# EAGLE design Light Sensors (EAGLE 8.7.0)
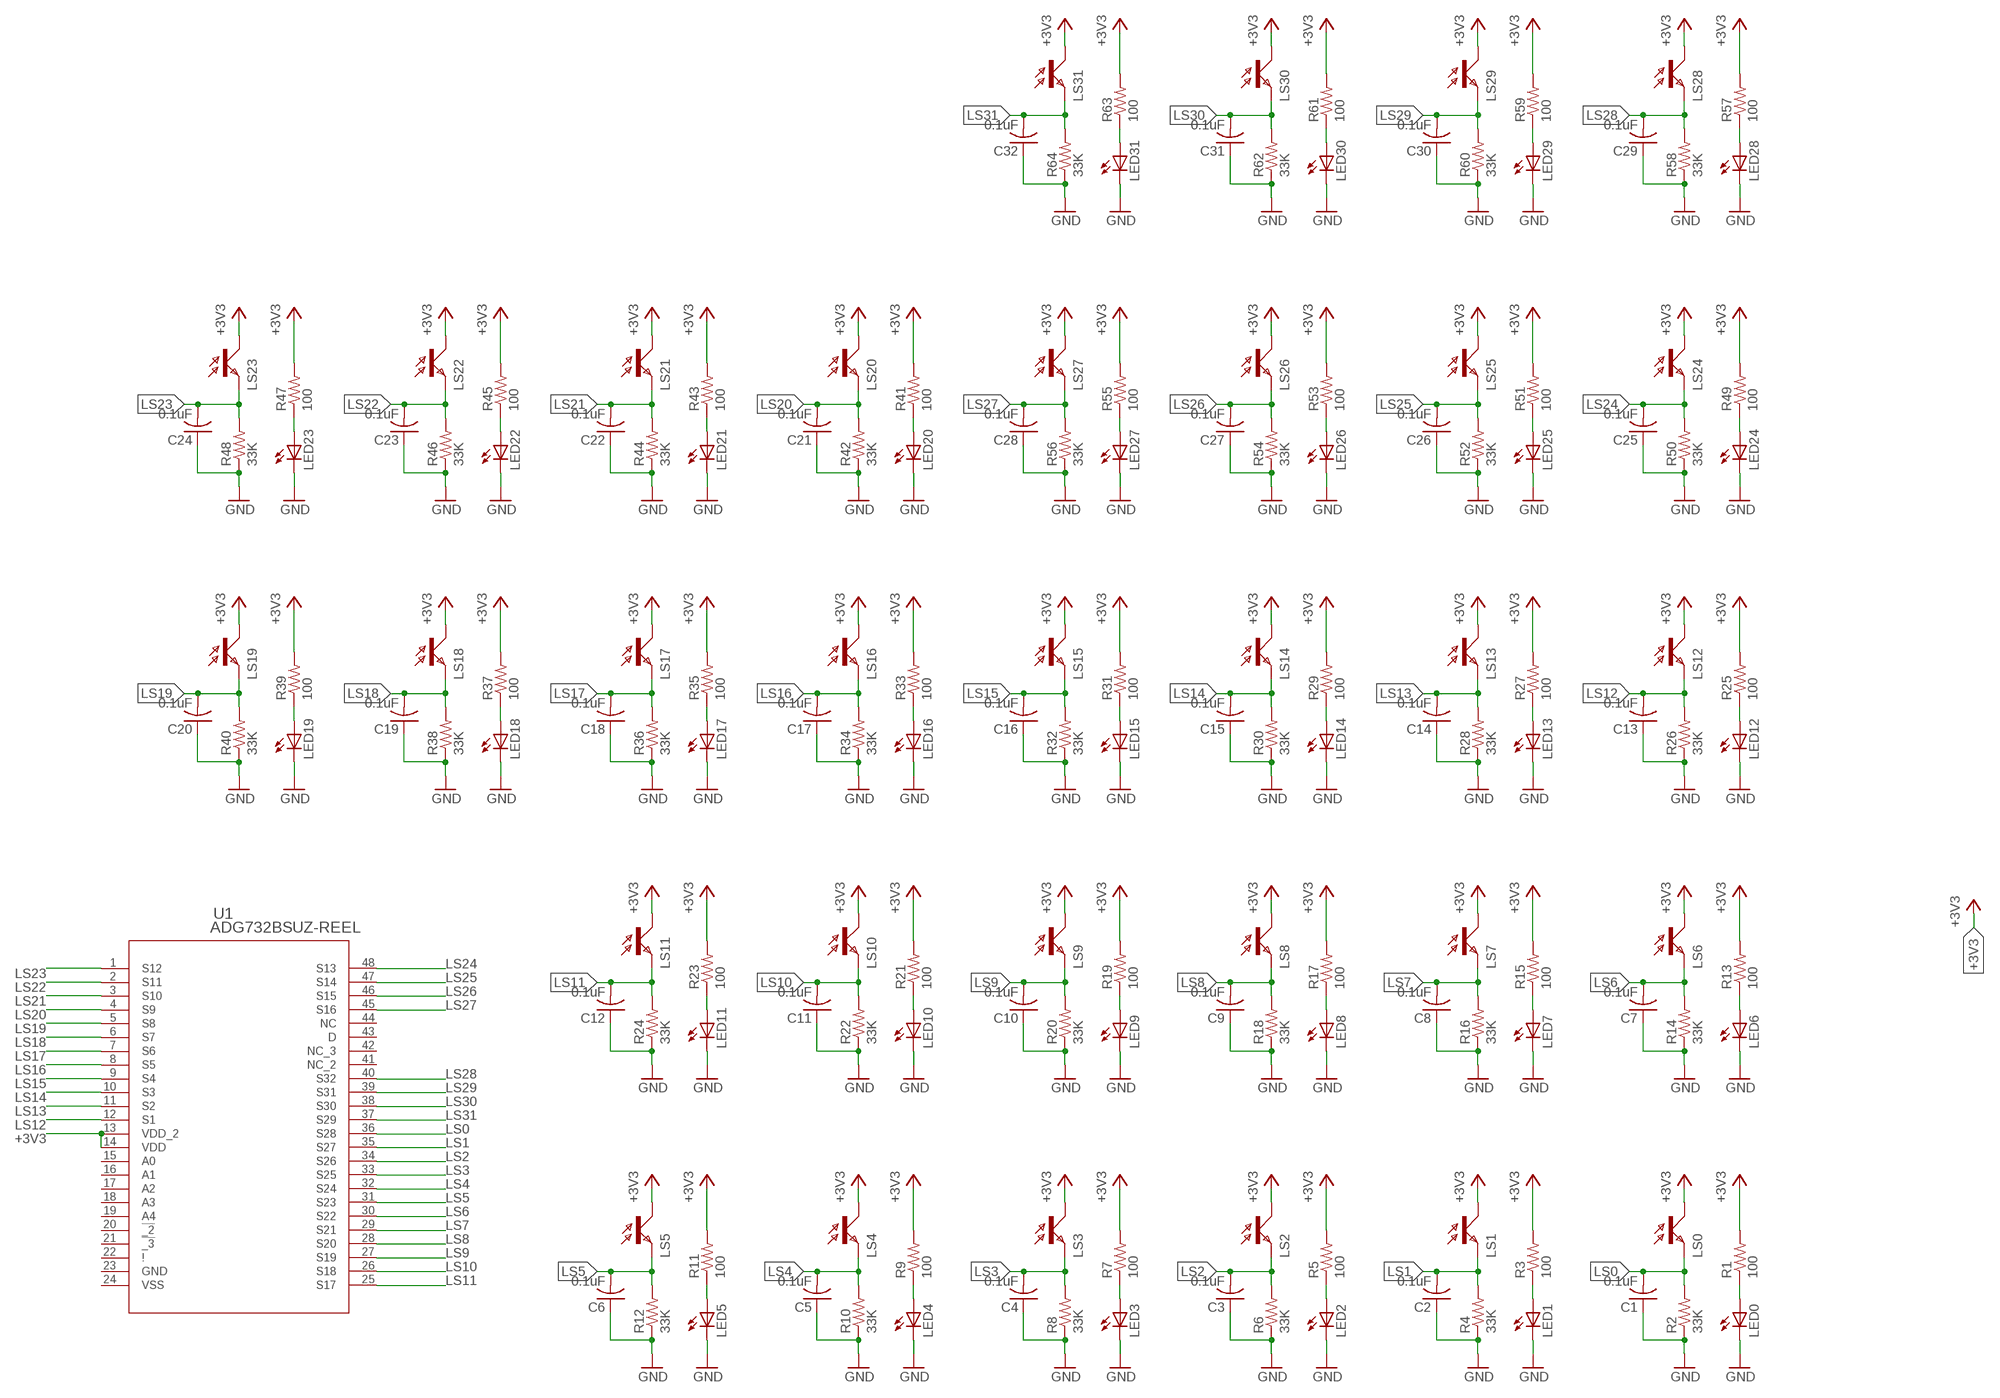
[diagram p0: schematic, sheet 1]

## Parts
C1  0.1uF  C-USC0603  [C0603]
C2  0.1uF  C-USC0603  [C0603]
C3  0.1uF  C-USC0603  [C0603]
C4  0.1uF  C-USC0603  [C0603]
C5  0.1uF  C-USC0603  [C0603]
C6  0.1uF  C-USC0603  [C0603]
C7  0.1uF  C-USC0603  [C0603]
C8  0.1uF  C-USC0603  [C0603]
C9  0.1uF  C-USC0603  [C0603]
C10  0.1uF  C-USC0603  [C0603]
C11  0.1uF  C-USC0603  [C0603]
C12  0.1uF  C-USC0603  [C0603]
C13  0.1uF  C-USC0603  [C0603]
C14  0.1uF  C-USC0603  [C0603]
C15  0.1uF  C-USC0603  [C0603]
C16  0.1uF  C-USC0603  [C0603]
C17  0.1uF  C-USC0603  [C0603]
C18  0.1uF  C-USC0603  [C0603]
C19  0.1uF  C-USC0603  [C0603]
C20  0.1uF  C-USC0603  [C0603]
C21  0.1uF  C-USC0603  [C0603]
C22  0.1uF  C-USC0603  [C0603]
C23  0.1uF  C-USC0603  [C0603]
C24  0.1uF  C-USC0603  [C0603]
C25  0.1uF  C-USC0603  [C0603]
C26  0.1uF  C-USC0603  [C0603]
C27  0.1uF  C-USC0603  [C0603]
C28  0.1uF  C-USC0603  [C0603]
C29  0.1uF  C-USC0603  [C0603]
C30  0.1uF  C-USC0603  [C0603]
C31  0.1uF  C-USC0603  [C0603]
C32  0.1uF  C-USC0603  [C0603]
LED0  LEDCHIPLED_0603  [CHIPLED_0603]
LED1  LEDCHIPLED_0603  [CHIPLED_0603]
LED2  LEDCHIPLED_0603  [CHIPLED_0603]
LED3  LEDCHIPLED_0603  [CHIPLED_0603]
LED4  LEDCHIPLED_0603  [CHIPLED_0603]
LED5  LEDCHIPLED_0603  [CHIPLED_0603]
LED6  LEDCHIPLED_0603  [CHIPLED_0603]
LED7  LEDCHIPLED_0603  [CHIPLED_0603]
LED8  LEDCHIPLED_0603  [CHIPLED_0603]
LED9  LEDCHIPLED_0603  [CHIPLED_0603]
LED10  LEDCHIPLED_0603  [CHIPLED_0603]
LED11  LEDCHIPLED_0603  [CHIPLED_0603]
LED12  LEDCHIPLED_0603  [CHIPLED_0603]
LED13  LEDCHIPLED_0603  [CHIPLED_0603]
LED14  LEDCHIPLED_0603  [CHIPLED_0603]
LED15  LEDCHIPLED_0603  [CHIPLED_0603]
LED16  LEDCHIPLED_0603  [CHIPLED_0603]
LED17  LEDCHIPLED_0603  [CHIPLED_0603]
LED18  LEDCHIPLED_0603  [CHIPLED_0603]
LED19  LEDCHIPLED_0603  [CHIPLED_0603]
LED20  LEDCHIPLED_0603  [CHIPLED_0603]
LED21  LEDCHIPLED_0603  [CHIPLED_0603]
LED22  LEDCHIPLED_0603  [CHIPLED_0603]
LED23  LEDCHIPLED_0603  [CHIPLED_0603]
LED24  LEDCHIPLED_0603  [CHIPLED_0603]
LED25  LEDCHIPLED_0603  [CHIPLED_0603]
LED26  LEDCHIPLED_0603  [CHIPLED_0603]
LED27  LEDCHIPLED_0603  [CHIPLED_0603]
LED28  LEDCHIPLED_0603  [CHIPLED_0603]
LED29  LEDCHIPLED_0603  [CHIPLED_0603]
LED30  LEDCHIPLED_0603  [CHIPLED_0603]
LED31  LEDCHIPLED_0603  [CHIPLED_0603]
LS0  ALS  [SMD]
LS1  ALS  [SMD]
LS2  ALS  [SMD]
LS3  ALS  [SMD]
LS4  ALS  [SMD]
LS5  ALS  [SMD]
LS6  ALS  [SMD]
LS7  ALS  [SMD]
LS8  ALS  [SMD]
LS9  ALS  [SMD]
LS10  ALS  [SMD]
LS11  ALS  [SMD]
LS12  ALS  [SMD]
LS13  ALS  [SMD]
LS14  ALS  [SMD]
LS15  ALS  [SMD]
LS16  ALS  [SMD]
LS17  ALS  [SMD]
LS18  ALS  [SMD]
LS19  ALS  [SMD]
LS20  ALS  [SMD]
LS21  ALS  [SMD]
LS22  ALS  [SMD]
LS23  ALS  [SMD]
LS24  ALS  [SMD]
LS25  ALS  [SMD]
LS26  ALS  [SMD]
LS27  ALS  [SMD]
LS28  ALS  [SMD]
LS29  ALS  [SMD]
LS30  ALS  [SMD]
LS31  ALS  [SMD]
R1  100  R-US_R0603  [R0603]
R2  33K  R-US_R0603  [R0603]
R3  100  R-US_R0603  [R0603]
R4  33K  R-US_R0603  [R0603]
R5  100  R-US_R0603  [R0603]
R6  33K  R-US_R0603  [R0603]
R7  100  R-US_R0603  [R0603]
R8  33K  R-US_R0603  [R0603]
R9  100  R-US_R0603  [R0603]
R10  33K  R-US_R0603  [R0603]
R11  100  R-US_R0603  [R0603]
R12  33K  R-US_R0603  [R0603]
R13  100  R-US_R0603  [R0603]
R14  33K  R-US_R0603  [R0603]
R15  100  R-US_R0603  [R0603]
R16  33K  R-US_R0603  [R0603]
R17  100  R-US_R0603  [R0603]
R18  33K  R-US_R0603  [R0603]
R19  100  R-US_R0603  [R0603]
R20  33K  R-US_R0603  [R0603]
R21  100  R-US_R0603  [R0603]
R22  33K  R-US_R0603  [R0603]
R23  100  R-US_R0603  [R0603]
R24  33K  R-US_R0603  [R0603]
R25  100  R-US_R0603  [R0603]
R26  33K  R-US_R0603  [R0603]
R27  100  R-US_R0603  [R0603]
R28  33K  R-US_R0603  [R0603]
R29  100  R-US_R0603  [R0603]
R30  33K  R-US_R0603  [R0603]
R31  100  R-US_R0603  [R0603]
R32  33K  R-US_R0603  [R0603]
R33  100  R-US_R0603  [R0603]
R34  33K  R-US_R0603  [R0603]
R35  100  R-US_R0603  [R0603]
R36  33K  R-US_R0603  [R0603]
R37  100  R-US_R0603  [R0603]
R38  33K  R-US_R0603  [R0603]
R39  100  R-US_R0603  [R0603]
R40  33K  R-US_R0603  [R0603]
R41  100  R-US_R0603  [R0603]
R42  33K  R-US_R0603  [R0603]
R43  100  R-US_R0603  [R0603]
R44  33K  R-US_R0603  [R0603]
R45  100  R-US_R0603  [R0603]
R46  33K  R-US_R0603  [R0603]
R47  100  R-US_R0603  [R0603]
R48  33K  R-US_R0603  [R0603]
R49  100  R-US_R0603  [R0603]
R50  33K  R-US_R0603  [R0603]
R51  100  R-US_R0603  [R0603]
R52  33K  R-US_R0603  [R0603]
R53  100  R-US_R0603  [R0603]
R54  33K  R-US_R0603  [R0603]
R55  100  R-US_R0603  [R0603]
R56  33K  R-US_R0603  [R0603]
R57  100  R-US_R0603  [R0603]
R58  33K  R-US_R0603  [R0603]
R59  100  R-US_R0603  [R0603]
R60  33K  R-US_R0603  [R0603]
R61  100  R-US_R0603  [R0603]
R62  33K  R-US_R0603  [R0603]
R63  100  R-US_R0603  [R0603]
R64  33K  R-US_R0603  [R0603]
U1  ADG732BSUZ-REEL  [SU_48]

## Nets
+3V3: LS0.C LS1.C LS2.C LS3.C LS4.C LS5.C LS6.C LS7.C LS8.C LS9.C LS10.C LS11.C LS12.C LS13.C LS14.C LS15.C LS16.C LS17.C LS18.C LS19.C LS20.C LS21.C LS22.C LS23.C LS24.C LS25.C LS26.C LS27.C LS28.C LS29.C LS30.C LS31.C R1.2 R3.2 R5.2 R7.2 R9.2 R11.2 R13.2 R15.2 R17.2 R19.2 R21.2 R23.2 R25.2 R27.2 R29.2 R31.2 R33.2 R35.2 R37.2 R39.2 R41.2 R43.2 R45.2 R47.2 R49.2 R51.2 R53.2 R55.2 R57.2 R59.2 R61.2 R63.2 U1.13(VDD_2) U1.14(VDD)
GND: C1.1 C2.1 C3.1 C4.1 C5.1 C6.1 C7.1 C8.1 C9.1 C10.1 C11.1 C12.1 C13.1 C14.1 C15.1 C16.1 C17.1 C18.1 C19.1 C20.1 C21.1 C22.1 C23.1 C24.1 C25.1 C26.1 C27.1 C28.1 C29.1 C30.1 C31.1 C32.1 LED0.C LED1.C LED2.C LED3.C LED4.C LED5.C LED6.C LED7.C LED8.C LED9.C LED10.C LED11.C LED12.C LED13.C LED14.C LED15.C LED16.C LED17.C LED18.C LED19.C LED20.C LED21.C LED22.C LED23.C LED24.C LED25.C LED26.C LED27.C LED28.C LED29.C LED30.C LED31.C R2.1 R4.1 R6.1 R8.1 R10.1 R12.1 R14.1 R16.1 R18.1 R20.1 R22.1 R24.1 R26.1 R28.1 R30.1 R32.1 R34.1 R36.1 R38.1 R40.1 R42.1 R44.1 R46.1 R48.1 R50.1 R52.1 R54.1 R56.1 R58.1 R60.1 R62.1 R64.1
LS0: C1.2 LS0.E R2.2 U1.36(S28)
LS1: C2.2 LS1.E R4.2 U1.35(S27)
LS2: C3.2 LS2.E R6.2 U1.34(S26)
LS3: C4.2 LS3.E R8.2 U1.33(S25)
LS4: C5.2 LS4.E R10.2 U1.32(S24)
LS5: C6.2 LS5.E R12.2 U1.31(S23)
LS6: C7.2 LS6.E R14.2 U1.30(S22)
LS7: C8.2 LS7.E R16.2 U1.29(S21)
LS8: C9.2 LS8.E R18.2 U1.28(S20)
LS9: C10.2 LS9.E R20.2 U1.27(S19)
LS10: C11.2 LS10.E R22.2 U1.26(S18)
LS11: C12.2 LS11.E R24.2 U1.25(S17)
LS12: C13.2 LS12.E R26.2 U1.12(S1)
LS13: C14.2 LS13.E R28.2 U1.11(S2)
LS14: C15.2 LS14.E R30.2 U1.10(S3)
LS15: C16.2 LS15.E R32.2 U1.9(S4)
LS16: C17.2 LS16.E R34.2 U1.8(S5)
LS17: C18.2 LS17.E R36.2 U1.7(S6)
LS18: C19.2 LS18.E R38.2 U1.6(S7)
LS19: C20.2 LS19.E R40.2 U1.5(S8)
LS20: C21.2 LS20.E R42.2 U1.4(S9)
LS21: C22.2 LS21.E R44.2 U1.3(S10)
LS22: C23.2 LS22.E R46.2 U1.2(S11)
LS23: C24.2 LS23.E R48.2 U1.1(S12)
LS24: C25.2 LS24.E R50.2 U1.48(S13)
LS25: C26.2 LS25.E R52.2 U1.47(S14)
LS26: C27.2 LS26.E R54.2 U1.46(S15)
LS27: C28.2 LS27.E R56.2 U1.45(S16)
LS28: C29.2 LS28.E R58.2 U1.40(S32)
LS29: C30.2 LS29.E R60.2 U1.39(S31)
LS30: C31.2 LS30.E R62.2 U1.38(S30)
LS31: C32.2 LS31.E R64.2 U1.37(S29)
N$1: LED0.A R1.1
N$2: LED1.A R3.1
N$3: LED2.A R5.1
N$4: LED3.A R7.1
N$5: LED4.A R9.1
N$6: LED5.A R11.1
N$7: LED6.A R13.1
N$8: LED7.A R15.1
N$9: LED8.A R17.1
N$10: LED9.A R19.1
N$11: LED10.A R21.1
N$12: LED11.A R23.1
N$13: LED12.A R25.1
N$14: LED13.A R27.1
N$15: LED14.A R29.1
N$16: LED15.A R31.1
N$17: LED16.A R33.1
N$18: LED17.A R35.1
N$19: LED18.A R37.1
N$20: LED19.A R39.1
N$21: LED20.A R41.1
N$22: LED21.A R43.1
N$23: LED22.A R45.1
N$24: LED23.A R47.1
N$25: LED24.A R49.1
N$26: LED25.A R51.1
N$27: LED26.A R53.1
N$28: LED27.A R55.1
N$29: LED28.A R57.1
N$30: LED29.A R59.1
N$31: LED30.A R61.1
N$32: LED31.A R63.1
Unconnected: U1.15(A0) U1.16(A1) U1.17(A2) U1.18(A3) U1.19(A4) U1.20(!_2) U1.21(!_3) U1.22(!) U1.23(GND) U1.41(NC_2) U1.42(NC_3) U1.43(D) U1.44(NC)

## Power pins joined to a net without a drawn wire
VSS: U1.24(VSS)

## Library data of the parts
C1-C32 = adafruit:C-US: CAPACITOR, American symbol
LED0 LED1-LED31 = adafruit:LED: LED OSRAM: - CHIPLED LG R971, LG N971, LY N971, LG Q971, LY Q971, LO R971, LY R971 LH N974, LH R974 LS Q976, LO Q976, LY Q976 LO Q996 - Hyper CHIPLED LW Q18S LB Q993, LB Q99A, LB R99A - SideLED LS A670, LO A670, LY A670, LG A670, LP A670 LB A673, LV A673, LT A673, LW A673 LH A674 LY A675 LS A676, LA A676, LO A676, LY A676, LW A676 LS A679, LY A679, LG A679 - Hyper Micro SIDELED® LS Y876, LA Y876, LO Y876, LY Y876 LT Y87S - SmartLED LW L88C, LW L88S LB L89C, LB L89S, LG L890 LS L89K, LO L89K, LY L89K LS L896, LA L896, LO L896, LY L896 - TOPLED LS T670, LO T670, LY T670, LG T670, LP T670 LSG T670, LSP T670, LSY T670, LOP T670, LYG T670 LG T671, LOG T671, LSG T671 LB T673, LV T673, LT T673, LW T673 LH T674 LS T676, LA T676, LO T676, LY T676, LB T676, LH T676, LSB T676, LW T676 LB T67C, LV T67C, LT T67C, LS T67K, LO T67K, LY T67K, LW E67C LS E67B, LA E67B, LO E67B, LY E67B, LB E67C, LV E67C, LT E67C LW T67C LS T679, LY T679, LG T679 LS T770, LO T770, LY T770, LG T770, LP T770 LB T773, LV T773, LT T773, LW T773 LH T774 LS E675, LA E675, LY E675, LS T675 LS T776, LA T776, LO T776, LY T776, LB T776 LHGB T686 LT T68C, LB T68C - Hyper Mini TOPLED® LB M676 - Mini TOPLED Santana® LG M470 LS M47K, LO M47K, LY M47K Source: http://www.osram.convergy.de/
LS0 LS1-LS31 = phototransitor-ALS-PT19-315CL177TR8:ALS
R1-R64 = adafruit:R-US_: RESISTOR, American symbol
U1 = ADG732:ADG732BSUZ-REEL; MANUFACTURER_PART_NUMBER: ADG732BSUZREEL; VENDOR: Analog Devices Inc

## Board
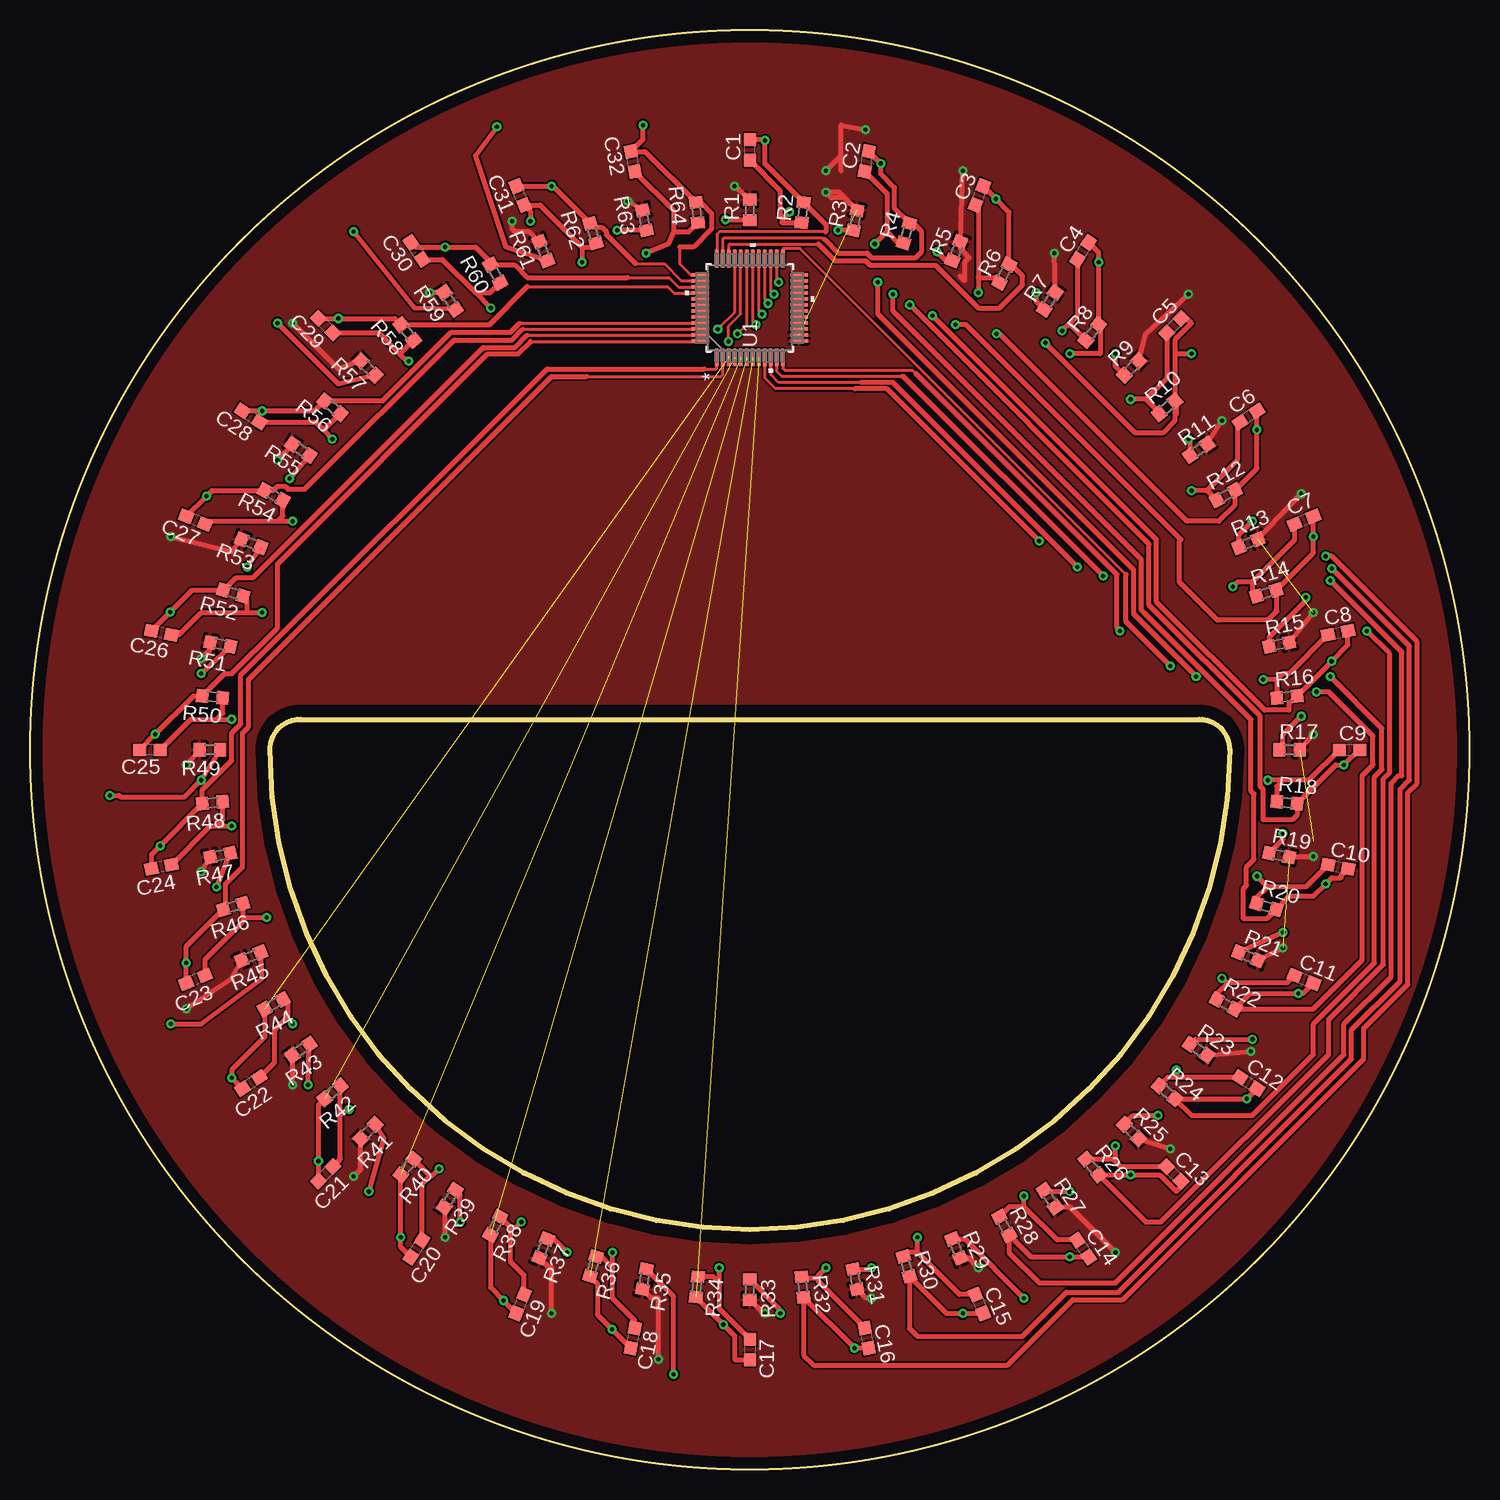
[diagram p1: board, top side]
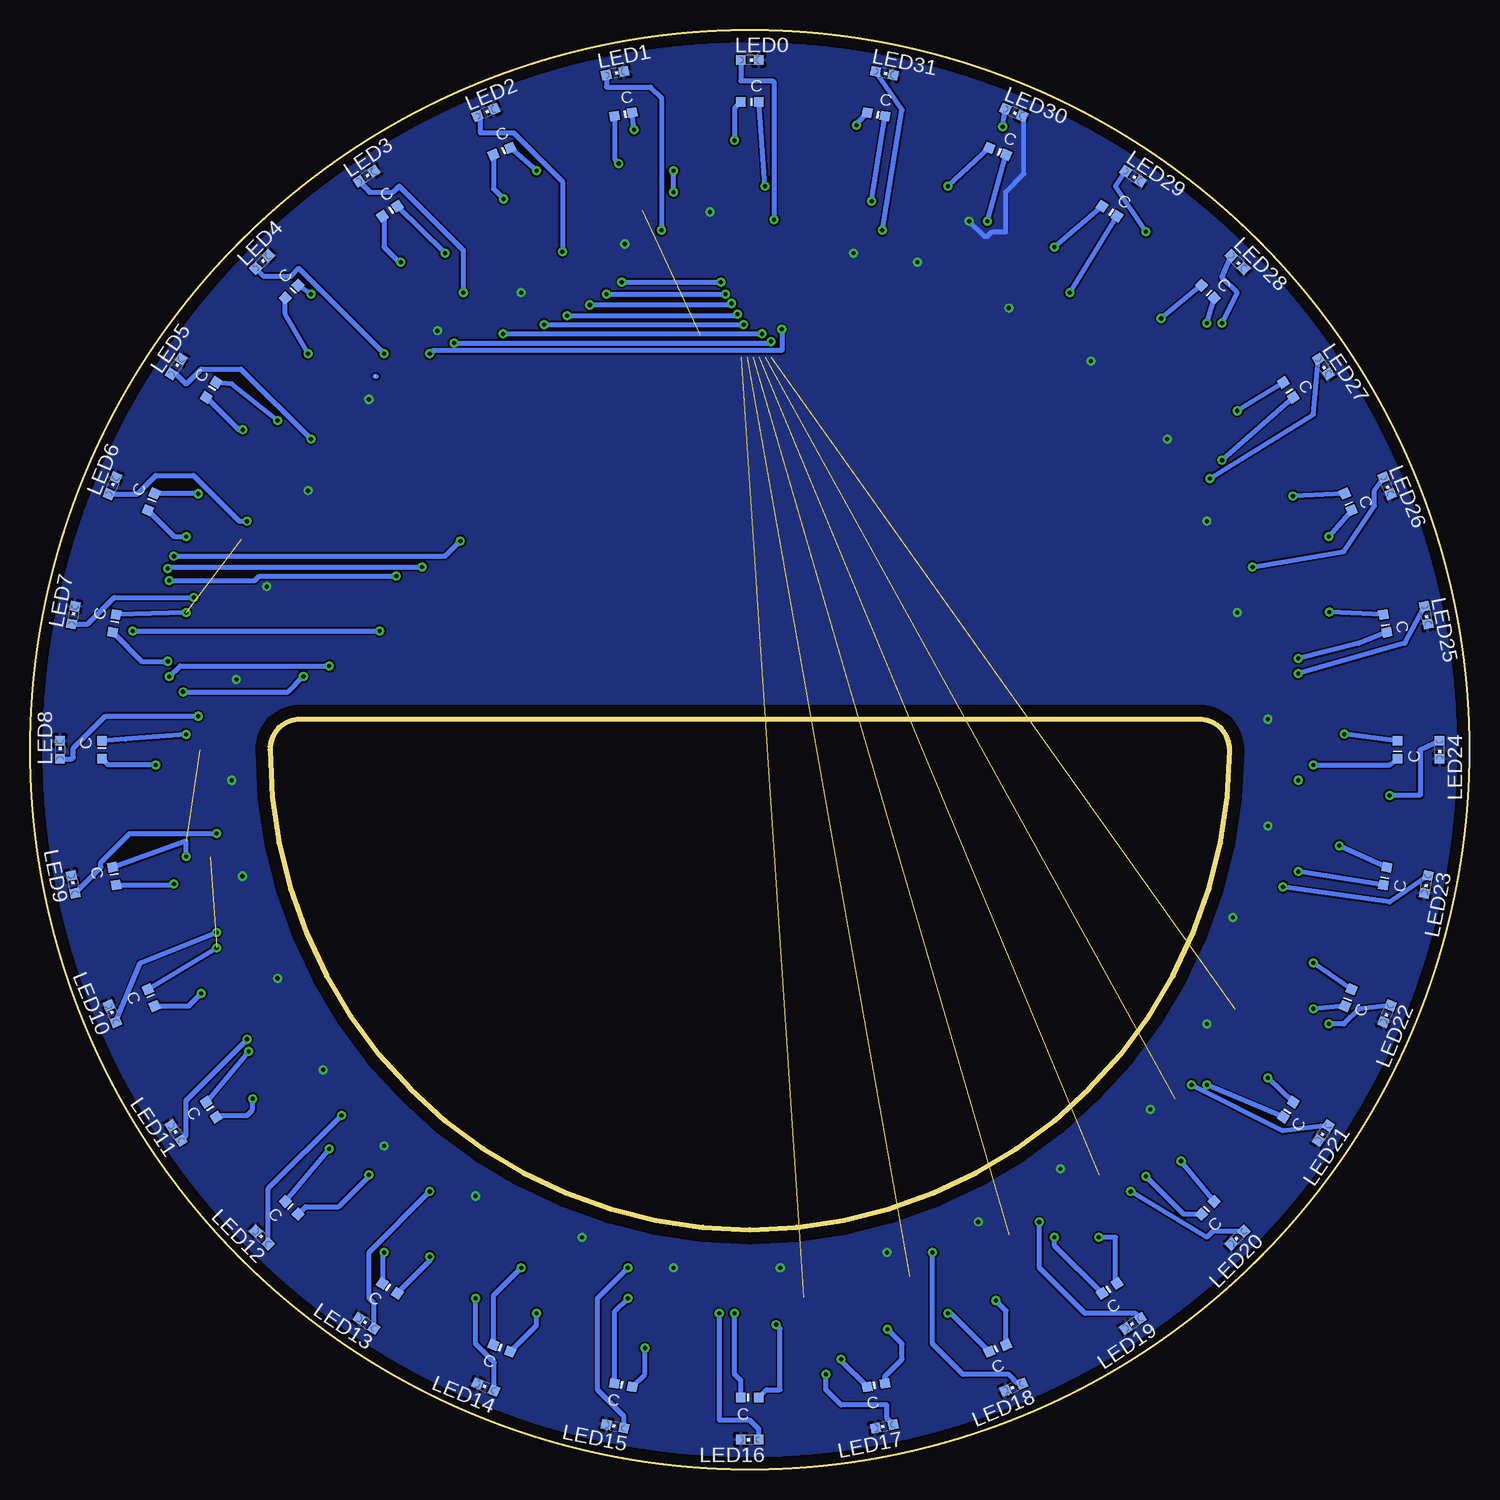
[diagram p2: board, bottom side, seen from below]

Size 120 x 120 mm. Coordinates in mm from the lower left corner, seen from the top.
Outline: 100,60 arc-180 20,60 arc-90 22.54,62.54 97.46,62.54 arc-90 100,60
Outline: circle at 60,60 radius 60
Copper layers (1*16): Top 0.035mm / dielectric 1.5mm / Bottom 0.035mm
Design rules "default": minimum track width 6mil, minimum drill 0.35mm, track to track 6mil, track to pad 6mil, pad to pad 6mil, via to via 6mil, smd to smd 6mil, copper to edge 40mil, drill to drill 6mil, minimum pad ring 10mil, minimum via ring 8mil, stop-mask expansion 4mil, vias tented up to drill 0mil, thermal gap 10mil

### Footprints (pad centres in the part's own frame; a part is rotated, then mirrored left to right if it is on the bottom)
C0603 = smd 1.1 x 1: 1 -0.85,0; 2 0.85,0
CHIPLED_0603 = smd 0.8 x 0.8: A 0,-0.75; C 0,0.75
SMD = smd 0.8 x 0.8: C -0.75,0; E 0.75,0
R0603 = smd 1 x 1.1: 1 -0.85,0; 2 0.85,0
SU_48 = smd 1.473 x 0.279: 1 -4.115,2.75; 2 -4.115,2.25; 3 -4.115,1.75; 4 -4.115,1.25; 5 -4.115,0.75; 6 -4.115,0.25; 7 -4.115,-0.25; 8 -4.115,-0.75; 9 -4.115,-1.25; 10 -4.115,-1.75; 11 -4.115,-2.25; 12 -4.115,-2.75; 25 4.115,-2.75; 26 4.115,-2.25; 27 4.115,-1.75; 28 4.115,-1.25; 29 4.115,-0.75; 30 4.115,-0.25; 31 4.115,0.25; 32 4.115,0.75; 33 4.115,1.25; 34 4.115,1.75; 35 4.115,2.25; 36 4.115,2.75 | smd 0.279 x 1.473: 13 -2.75,-4.115; 14 -2.25,-4.115; 15 -1.75,-4.115; 16 -1.25,-4.115; 17 -0.75,-4.115; 18 -0.25,-4.115; 19 0.25,-4.115; 20 0.75,-4.115; 21 1.25,-4.115; 22 1.75,-4.115; 23 2.25,-4.115; 24 2.75,-4.115; 37 2.75,4.115; 38 2.25,4.115; 39 1.75,4.115; 40 1.25,4.115; 41 0.75,4.115; 42 0.25,4.115; 43 -0.25,4.115; 44 -0.75,4.115; 45 -1.25,4.115; 46 -1.75,4.115; 47 -2.25,4.115; 48 -2.75,4.115

### Placement (x,y rotation side)
C1  60,110 90 top
C2  69.75,109.04 78.8 top
C3  79.13,106.19 67.5 top
C4  87.78,101.57 56.3 top
C5  95.36,95.36 45 top
C6  101.57,87.78 33.8 top
C7  106.19,79.13 22.5 top
C8  109.04,69.75 11.3 top
C9  110,60 0 top
C10  109.04,50.25 348.8 top
C11  106.19,40.87 337.5 top
C12  101.57,32.22 326.3 top
C13  95.36,24.64 315 top
C14  87.78,18.43 303.8 top
C15  79.13,13.81 292.5 top
C16  69.75,10.96 281.3 top
C17  60,10 270 top
C18  50.25,10.96 258.8 top
C19  40.87,13.81 247.5 top
C20  32.22,18.43 236.3 top
C21  24.64,24.64 225 top
C22  18.43,32.22 213.8 top
C23  13.81,40.87 202.5 top
C24  10.96,50.25 191.3 top
C25  10,60 180 top
C26  10.96,69.75 168.8 top
C27  13.81,79.13 157.5 top
C28  18.43,87.78 146.3 top
C29  24.64,95.36 135 top
C30  32.22,101.57 123.8 top
C31  40.87,106.19 112.5 top
C32  50.25,109.04 101.3 top
LED0  60,117.5 270 bottom
LED1  71.22,116.4 281.2 bottom
LED2  82,113.12 292.5 bottom
LED3  91.95,107.81 303.7 bottom
LED4  100.66,100.66 315 bottom
LED5  107.81,91.95 326.2 bottom
LED6  113.12,82 337.5 bottom
LED7  116.4,71.22 348.7 bottom
LED8  117.5,60 0 bottom
LED9  116.4,48.78 11.2 bottom
LED10  113.12,38 22.5 bottom
LED11  107.81,28.05 33.7 bottom
LED12  100.66,19.34 45 bottom
LED13  91.95,12.19 56.2 bottom
LED14  82,6.88 67.5 bottom
LED15  71.22,3.6 78.7 bottom
LED16  60,2.5 90 bottom
LED17  48.78,3.6 101.2 bottom
LED18  38,6.88 112.5 bottom
LED19  28.05,12.19 123.7 bottom
LED20  19.34,19.34 135 bottom
LED21  12.19,28.05 146.2 bottom
LED22  6.88,38 157.5 bottom
LED23  3.6,48.78 168.7 bottom
LED24  2.5,60 180 bottom
LED25  3.6,71.22 191.2 bottom
LED26  6.88,82 202.5 bottom
LED27  12.19,91.95 213.7 bottom
LED28  19.34,100.66 225 bottom
LED29  28.05,107.81 236.2 bottom
LED30  38,113.12 247.5 bottom
LED31  48.78,116.4 258.7 bottom
LS0  60,114 180 bottom
LS1  70.53,112.96 191.2 bottom
LS2  80.66,109.89 202.5 bottom
LS3  90,104.9 213.7 bottom
LS4  98.18,98.18 225 bottom
LS5  104.9,90 236.2 bottom
LS6  109.89,80.66 247.5 bottom
LS7  112.96,70.53 258.7 bottom
LS8  114,60 270 bottom
LS9  112.96,49.47 281.2 bottom
LS10  109.89,39.34 292.5 bottom
LS11  104.9,30 303.7 bottom
LS12  98.18,21.82 315 bottom
LS13  90,15.1 326.2 bottom
LS14  80.66,10.11 337.5 bottom
LS15  70.53,7.04 348.7 bottom
LS16  60,6 0 bottom
LS17  49.47,7.04 11.2 bottom
LS18  39.34,10.11 22.5 bottom
LS19  30,15.1 33.7 bottom
LS20  21.82,21.82 45 bottom
LS21  15.1,30 56.2 bottom
LS22  10.11,39.34 67.5 bottom
LS23  7.04,49.47 78.7 bottom
LS24  6,60 90 bottom
LS25  7.04,70.53 101.2 bottom
LS26  10.11,80.66 112.5 bottom
LS27  15.1,90 123.7 bottom
LS28  21.82,98.18 135 bottom
LS29  30,104.9 146.2 bottom
LS30  39.34,109.89 157.5 bottom
LS31  49.47,112.96 168.7 bottom
R1  60,105 90 top
R2  64.41,104.78 84.4 top
R3  68.78,104.14 78.8 top
R4  73.06,103.06 73.1 top
R5  77.22,101.57 67.5 top
R6  81.21,99.69 61.9 top
R7  85,97.42 56.3 top
R8  88.55,94.79 50.6 top
R9  91.82,91.82 45 top
R10  94.79,88.55 39.4 top
R11  97.42,85 33.8 top
R12  99.69,81.21 28.1 top
R13  101.57,77.22 22.5 top
R14  103.06,73.06 16.9 top
R15  104.14,68.78 11.3 top
R16  104.78,64.41 5.6 top
R17  105,60 0 top
R18  104.78,55.59 354.4 top
R19  104.14,51.22 348.8 top
R20  103.06,46.94 343.1 top
R21  101.57,42.78 337.5 top
R22  99.69,38.79 331.9 top
R23  97.42,35 326.3 top
R24  94.79,31.45 320.6 top
R25  91.82,28.18 315 top
R26  88.55,25.21 309.4 top
R27  85,22.58 303.8 top
R28  81.21,20.31 298.1 top
R29  77.22,18.43 292.5 top
R30  73.06,16.94 286.9 top
R31  68.78,15.86 281.3 top
R32  64.41,15.22 275.6 top
R33  60,15 270 top
R34  55.59,15.22 264.4 top
R35  51.22,15.86 258.8 top
R36  46.94,16.94 253.1 top
R37  42.78,18.43 247.5 top
R38  38.79,20.31 241.9 top
R39  35,22.58 236.3 top
R40  31.45,25.21 230.6 top
R41  28.18,28.18 225 top
R42  25.21,31.45 219.4 top
R43  22.58,35 213.8 top
R44  20.31,38.79 208.1 top
R45  18.43,42.78 202.5 top
R46  16.94,46.94 196.9 top
R47  15.86,51.22 191.3 top
R48  15.22,55.59 185.6 top
R49  15,60 180 top
R50  15.22,64.41 174.4 top
R51  15.86,68.78 168.8 top
R52  16.94,73.06 163.1 top
R53  18.43,77.22 157.5 top
R54  20.31,81.21 151.9 top
R55  22.58,85 146.3 top
R56  25.21,88.55 140.6 top
R57  28.18,91.82 135 top
R58  31.45,94.79 129.4 top
R59  35,97.42 123.8 top
R60  38.79,99.69 118.1 top
R61  42.78,101.57 112.5 top
R62  46.94,103.06 106.9 top
R63  51.22,104.14 101.3 top
R64  55.59,104.78 95.6 top
U1  60,96.83 90 top

### Tracks (layer width: path | path; a pad name or v marks a point on that pad's centre or on a via)
+3V3  (via drill 0.35)  (4 unrouted)
  Top 0.406: v61.27,13.01 61.14,13.01 R33.2 | v70.16,14.28 69.7,14.28 R31.2 | v79.05,16.82 78.23,17.64 R29.2 | 86.67,21.9 85.5,21.9 R27.2 86.69,21.88 v90.48,18.09 | v52.38,9.2 52.38,14.28 51.81,14.28 R35.2 | v43.49,13.01 43.49,16.82 43.27,16.82 R37.2 | v34.6,19.36 34.6,21.8 R39.2 | v26.98,24.44 27.58,25.04 R41.2 | v21.9,32.06 R43.2 | v13.01,38.41 16.82,40.95 R45.2 | R47.2 v14.28,49.84 | R49.2 v13.01,58.73 | v11.74,77.78 16.82,76.51 R53.2 | R55.2 v20.63,84.13 | R57.2 25.71,91.75 v21.9,95.56 | R59.2 v33.33,98.1 | R63.2 v49.84,105.72 | v104.45,43.49 R21.2 | R25.2 v95.05,26.73 | R23.2 v101.78,34.85 | R17.2 v106.99,61.27 | R15.2 v106.99,71.43 | R13.2 v105.97,81.34 | R11.2 v99.37,87.43 | R9.2 93.02,94.67 v96.58,97.97 | R7.2 v85.4,101.4 | v77.78,108.26 R5.2 77.55,101.76 78.29,101.02 77.91,100.64 77.91,99.12 77.53,99.5 | 67.62,108.26 67.62,109.53 | 67.62,109.53 67.62,112.07 v69.65,111.69 | R1.2 v58.73,106.99 | R3.2 67.91,106.01 | 67.91,106.01 67.43,106.48 v66.35,106.48 66.83,106.01 67.91,106.01 | v66.35,108.26 67.62,109.53 | R61.2 41.63,103.18 40.44,103.18 40.19,103.43 v40.19,104.07 | v14.28,67.62 15.03,68.37 R51.2 | R19.2 105.72,51.08 v106.99,51.11 105.02,51.11 R19.2
  Bottom 0.406: 90.48,15.66 LS13.C 90.62,17.95 v90.48,18.09 | LS14.C 81.36,14.51 v79.05,16.82 | LS15.C 71.27,13.17 v70.16,14.28 | LS16.C 60.75,7.41 61.27,7.93 v61.27,13.01 | LS17.C 52.38,9.07 v52.38,9.2 | 40.3,9.82 LS18.C 43.22,13.01 v43.49,13.01 | LS19.C 34.6,18.66 v34.6,19.36 | LS20.C 23.83,21.29 v26.98,24.44 | LS21.C v21.9,32.06 | LS22.C v13.01,38.41 | LS23.C v14.28,49.84 | v13.01,58.73 6.66,58.73 LS24.C | LS25.C 9.2,68.89 v14.28,67.62 | LS26.C v11.74,77.78 | v20.63,84.13 LS27.C | v21.9,95.56 LS28.C | v33.33,98.1 LS29.C | v40.19,104.07 LS30.C | v49.84,105.72 LS31.C | LS10.C v104.45,43.49 | v95.05,26.73 LS12.C | v101.78,34.85 LS11.C | v106.99,51.11 106.99,52.38 LS9.C | v106.99,61.27 112.04,60.9 LS8.C | v106.99,71.43 LS7.C | v105.97,81.34 LS6.C | v99.37,87.43 103.18,90.48 LS5.C | v96.58,97.97 LS4.C | v85.4,101.4 LS3.C | v77.78,108.26 LS2.C | v69.65,111.69 LS1.C | v58.73,106.99 LS0.C | v66.35,106.48 v66.35,108.26
  pour Top: 100.64,112.07 89.21,123.5 71.43,123.5 35.87,123.5 30.79,118.42 25.71,118.42 9.2,101.91 4.12,96.83 4.12,93.02 -3.5,85.4 -3.5,67.62 -3.5,43.49 1.58,38.41 1.58,29.52 10.47,20.63 25.71,5.39 28.25,5.39 35.87,-2.23 53.65,-2.23 81.59,-2.23 82.86,-0.96 86.67,-0.96 96.83,9.2 98.1,9.2 112.07,23.17 119.69,30.79 119.69,39.68 122.23,42.22 122.23,56.19 122.23,79.05 117.15,84.13 117.15,91.75 106.99,101.91 106.99,105.72
GND  (via drill 0.35)
  Top 0.406: C1.1 62.54,106.61 62.54,104.45 | 62.54,104.45 62.67,104.32 62.67,103.94 63.81,103.94 | 63.81,103.94 R2.1 63.81,103.94 | C2.1 71.43,106.37 71.43,103.18 | 71.43,103.18 72.36,102.25 R4.1 | 71.43,103.18 v70.41,102.16 | C3.1 79.05,105.17 79.05,99.37 | 79.05,99.37 80.38,99.37 R6.1 | 79.05,99.37 v79.05,98.1 | C4.1 87.31,96.2 86.67,95.56 | 86.67,95.56 86.67,95.47 R8.1 | 86.67,95.56 v86.03,94.92 | C5.1 94.75,90.94 93.02,89.21 | 93.02,89.21 94.13,88.1 R10.1 | 93.02,89.21 v91.75,89.21 | C6.1 100.64,87.08 100.64,84.13 98.1,81.59 | 98.1,81.59 98.16,81.59 R12.1 | 98.1,81.59 v96.83,81.59 | C7.1 105.41,77.47 101.91,73.97 | 101.91,73.97 101.91,73.16 R14.1 | C8.1 104.97,66.35 104.45,66.35 103.94,65.84 | 103.94,65.84 R16.1 | 103.94,65.84 v102.8,65.84 | C9.1 106.61,57.46 104.45,57.46 | 104.45,57.46 103.94,56.95 R18.1 | 104.45,57.46 v103.18,57.46 | C10.1 106.37,48.57 103.18,48.57 | 103.18,48.57 102.25,47.64 R20.1 | 103.18,48.57 v102.29,49.46 | C11.1 104.79,40.57 99.88,40.57 | 99.88,40.57 98.94,39.63 R22.1 | C12.1 95.56,32.69 | 95.56,32.69 94.83,32.69 R24.1 | 99.88,40.57 99.75,40.57 v99.37,40.95 | 95.56,32.69 v95.56,33.33 | C13.1 90.94,25.25 90.32,25.87 | 90.32,25.87 R26.1 | 90.32,25.87 90.48,26.03 v90.48,26.98 | C14.1 85.63,19.13 82.86,21.9 | 82.86,21.9 81.65,21.9 R28.1 | 82.86,21.9 v82.86,22.79 | C15.1 77.47,14.59 73.97,18.09 | 73.97,18.09 73.16,18.09 R30.1 | 73.97,18.09 v73.97,19.36 | C16.1 65.72,15.67 65.72,15.93 | 65.72,15.93 64.46,15.93 R32.1 | 65.72,15.93 65.72,16.19 v66.35,16.82 | C17.1 57.46,13.39 57.46,15.55 | 57.46,15.55 56.95,16.06 R34.1 | 57.46,15.55 v57.46,16.82 | C18.1 50.41,12.44 48.57,14.28 48.57,16.82 | 48.57,16.82 47.64,17.75 R36.1
  Top 0.406: 48.57,16.82 v48.57,18.09 | C19.1 41.19,16.2 40.06,17.33 40.06,20.19 | 40.06,20.19 R38.1 | 40.06,20.19 40.51,20.19 v40.95,20.63 | C20.1 32.69,23.8 33.33,24.44 | 33.33,24.44 33.33,24.53 R40.1 | 33.33,24.44 33.46,24.44 v34.09,25.08 | C21.1 25.87,25.87 25.87,29.52 | 25.87,29.52 R42.1 | 25.87,29.52 26.38,30.03 v26.6,30.03 | C22.1 20.38,33.94 20.38,36.63 21.39,37.65 | 21.39,37.65 21.52,37.65 21.52,38.73 R44.1 | 21.39,37.65 v21.9,37.14 | C23.1 14.59,42.53 17.75,45.69 17.75,46.03 | 17.75,46.03 R46.1 | C24.1 15.03,53.65 15.55,53.65 | 15.55,53.65 16.06,54.16 R48.1 | 15.55,53.65 v16.82,53.65 | C25.1 13.39,62.54 15.55,62.54 | 15.55,62.54 16.06,63.05 R50.1 | 15.55,62.54 v16.82,62.54 | C26.1 12.44,69.59 14.28,71.43 18.09,71.43 | 18.09,71.43 18.09,72.48 R52.1 | 18.09,71.43 v19.36,71.43 | C27.1 14.83,79.05 20.63,79.05 | 20.63,79.05 21.06,79.48 R54.1 | 20.63,79.05 v21.9,79.05 | C28.1 23.8,87.31 24.44,86.67 | 24.44,86.67 24.53,86.67 R56.1 | 24.44,86.67 v25.2,85.91 | C29.1 29.06,94.75 30.79,93.02 | 30.79,93.02 30.88,93.02 R58.1 | 30.79,93.02 31.43,92.38 v31.55,92.38 | C30.1 34.37,100.87 37.14,98.1 | 37.14,98.1 38.35,98.1 R60.1 | 37.14,98.1 v38.41,96.83 | 46.03,101.91 42.53,105.41 C31.1 41.71,104.89 v41.71,104.07 | 46.03,101.91 46.84,101.91 R62.1 | 46.03,101.91 v46.03,100.64 | C32.1 53.65,104.97 53.65,103.18 | 53.65,103.18 54.91,103.18 R64.1 | 17.75,46.03 v19.74,46.03 | 101.91,73.97 100.64,73.97 v100.26,73.59 | 62.54,104.45 62.92,104.45 v63.3,104.83 | 53.65,103.18 53.17,102.13 v51.36,101.4
  Bottom 0.406: v41.71,104.07 40.44,102.8 40.19,102.8 39.81,103.18 38.66,103.18 38.66,106.48 37.14,108.01 37.14,112.67 LED30.C
  pour Bottom: 18.09,114.61 2.85,99.37 2.85,93.02 -3.5,86.67 -3.5,67.62 -3.5,43.49 -0.96,40.95 -0.96,34.6 6.66,26.98 19.36,14.28 28.25,5.39 28.25,4.12 33.33,-0.96 42.22,-0.96 44.76,-3.5 57.46,-3.5 77.78,-3.5 82.86,1.58 91.75,1.58 103.18,13.01 115.88,25.71 120.96,30.79 120.96,42.22 123.5,44.76 123.5,63.81 123.5,82.86 115.88,90.48 115.88,94.29 104.45,105.72 91.75,118.42 87.94,118.42 84.13,122.23 71.43,122.23 58.73,122.23 57.46,123.5 26.98,123.5
LS0  (via drill 0.35)
  Top 0.254: 66.35,103.18 57.46,103.18 57.25,102.97 U1.36
  Top 0.406: C1.2 61.22,110.85 v61.27,110.8 61.27,108.85 R2.2 66.35,103.77 66.35,103.18
  Bottom 0.406: LS0.E 61.27,113.48 v61.27,110.8
LS1  (via drill 0.35)
  Top 0.254: U1.35 57.75,102.58 57.84,102.67 66.1,102.67 66.22,102.55
  Top 0.406: C2.2 v70.92,108.87 70.92,108.01 72.06,106.86 72.06,105.12 R4.2 73.66,103.88 74.35,103.18 74.35,101.53 73.84,101.02 70.16,101.02 69.78,101.4 67.37,101.4 66.22,102.55
  Bottom 0.406: LS1.E 71.27,109.24 70.92,108.9 v70.92,108.87
LS2  (via drill 0.35)
  Top 0.254: U1.34 58.25,102.06 58.35,102.16 65.72,102.16
  Top 0.406: R6.2 81.61,100.64 | 81.61,100.64 81.61,104.83 v80.52,105.92 C3.2 | 65.72,102.16 67.11,100.77 69.65,100.77 70.03,100.39 75.49,100.39 79.05,96.83 80.83,96.83 82.73,98.73 82.73,99.52 81.61,100.64
  Bottom 0.406: LS2.E 81.36,106.76 v80.52,105.92
LS3  (via drill 0.35)
  Top 0.254: v57.33,95.05 58.75,96.47 U1.33
  Top 0.406: C4.2 89.09,101.44 v89.09,100.64 R8.2 89.21,95.32 89.21,93.02 v86.67,93.02
  Bottom 0.406: LS3.E 90.48,104.34 90.48,101.91 89.21,100.64 v89.09,100.64 | v57.33,95.05 57.33,93.27 86.42,93.27 v86.67,93.02
LS4  (via drill 0.35)
  Top 0.254: v58.22,94.04 58.22,95.31 59.24,96.32 59.24,100.93 U1.32
  Top 0.406: C5.2 96.43,95.96 96.83,95.56 95.44,94.17 95.44,93.02 | 95.44,93.02 R10.2 | 95.44,93.02 v96.83,93.02 | R10.2 95.56,88.97 95.56,87.94 | R10.2 95.44,87.44 94.42,86.42 92.13,86.42 v84.64,93.91
  Bottom 0.406: LS4.E 98.71,96.29 v96.83,93.02 | v84.64,93.91 58.35,93.91 v58.22,94.04
LS5  (via drill 0.35)
  Top 0.254: v58.98,94.67 59.75,95.44 U1.31
  Top 0.406: C6.2 v102.28,86.67 102.28,83.46 R12.2 100.44,80.37 99.12,79.05 96.45,79.05 80.83,94.67 v80.57,94.67
  Bottom 0.406: LS5.E 102.61,86.67 v102.28,86.67 | v80.57,94.67 v58.98,94.67
LS6  (via drill 0.35)
  Top 0.254: v60.51,95.43 60.25,95.69 U1.30
  Top 0.406: C7.2 v106.98,77.78 106.98,76.41 R14.2 103.88,71.62 103.94,71.56 103.18,70.8 98.99,70.8 95.81,73.97 95.81,77.4 95.94,77.53 78.03,95.43 v77.14,95.43
  Bottom 0.406: LS6.E 107.98,77.78 v106.98,77.78 | v77.14,95.43 v60.51,95.43
LS7  (via drill 0.35)
  Top 0.254: 60.76,100.96 U1.29 60.75,96.59 v61.02,96.32
  Top 0.406: C8.2 109.87,68.74 v108.51,67.37 R16.2 104.96,63.82 104.96,63.3 102.93,63.3 93.91,72.32 93.91,77.53 v75.24,96.19
  Bottom 0.406: LS7.E 110.68,67.37 v108.51,67.37 | v75.24,96.19 61.14,96.19 v61.02,96.32
LS8  (via drill 0.35)
  Top 0.254: v61.52,97.21 61.25,97.48 U1.28
  Top 0.406: C9.2 110.8,60 v109.53,58.73 108.85,58.73 R18.2 105.63,54.58 105.21,54.16 102.8,54.16 102.8,56.7 102.55,56.95 102.55,62.79 93.27,72.06 93.27,77.14 v73.34,97.08
  Bottom 0.406: v109.53,58.73 113.48,58.73 LS8.E | v73.34,97.08 61.65,97.08 v61.52,97.21
LS9  (via drill 0.35)
  Top 0.254: v62.03,97.97 61.75,98.25 U1.27
  Top 0.406: C10.2 109.28,49.48 109.28,49.33 108.51,49.33 v108.01,48.82 106.99,47.81 104.99,47.81 R20.2 103.09,45.9 101.15,45.9 101.15,48.44 101.4,48.7 101.4,50.22 102.04,50.86 102.04,56.32 101.78,56.57 101.78,62.54 92.96,71.37 92.64,71.68 92.64,75.88 71.94,96.58 v71.94,97.97
  Bottom 0.406: LS9.E 108.1,48.73 v108.01,48.82 | v71.94,97.97 v62.03,97.97
LS10  (via drill 0.35)
  Top 0.254: v62.41,98.99 62.25,99.15 U1.26
  Top 0.406: C11.2 106.12,39.68 v105.72,39.68 101.73,39.68 R22.2 106.97,38.39 111.05,42.47 111.05,57.84 111.94,58.73 111.94,61.14 108.26,64.83 v107.24,64.83 | v97.21,66.1 92,71.3 92,74.99 70.67,96.32 v70.67,98.99
  Bottom 0.406: LS10.E 106.76,38.64 v105.72,39.68 | v107.24,64.83 98.48,64.83 v97.21,66.1 | v70.67,98.99 v62.41,98.99
LS11  (via drill 0.35)
  Top 0.254: 91.37,74.61 64.19,101.78 62.79,101.78 62.79,100.99 U1.25
  Top 0.406: C12.2 v101.44,30.91 R24.2 96.84,29.52 101.91,29.52 106.99,34.6 106.99,37.14 112.07,42.22 112.07,57.71 112.7,58.35 112.7,61.78 v108.39,66.1 | v95.05,66.98 91.37,70.67 91.37,74.61
  Bottom 0.406: LS11.E 104.34,29.52 101.91,29.52 101.44,29.99 v101.44,30.91 | v108.39,66.1 107.5,66.98 v95.05,66.98
LS12  (via drill 0.35)
  Top 0.254: U1.12 62.75,91.79 62.92,91.62 73.59,91.62 73.84,91.37
  Top 0.406: C13.2 95.96,23.57 95.56,23.17 94.17,24.56 v91.75,24.56 R26.2 93.02,20.63 94.29,20.63 108.26,34.6 108.26,37.52 112.83,42.09 112.83,57.59 113.34,58.09 113.34,68 v111.44,69.91 | v90.86,69.91 90.61,70.16 90.61,74.61 73.84,91.37
  Bottom 0.406: LS12.E 97.04,21.9 94.29,21.9 91.75,24.44 v91.75,24.56 | v111.44,69.91 v90.86,69.91
LS13  (via drill 0.35)
  Top 0.254: 72.7,91.11 62.67,91.11 62.25,91.53 U1.11
  Top 0.406: C14.2 v86.67,17.72 83.46,17.72 R28.2 81.61,18.07 84.13,15.55 90.48,15.55 109.53,34.6 109.53,37.14 113.47,41.08 113.47,57.21 114.1,57.84 114.36,57.84 114.36,68.13 v108.39,74.1 | v89.46,74.48 72.83,91.11 72.7,91.11
  Bottom 0.406: LS13.E 86.67,17.39 v86.67,17.72 | v108.39,74.1 101.28,74.1 100.89,74.48 v89.46,74.48
LS14  (via drill 0.35)
  Top 0.254: 69.27,90.61 62.41,90.61 61.75,91.27 U1.10
  Top 0.406: C15.2 v77.78,13.02 76.41,13.02 R30.2 73.31,11.77 73.97,11.1 82.73,11.1 86.42,14.79 90.73,14.79 110.16,34.22 110.16,36.63 114.23,40.7 114.23,56.7 114.99,57.46 114.99,68.64 v108.51,75.11 | v87.31,75.24 71.94,90.61 69.27,90.61
  Bottom 0.406: LS14.E 77.78,12.02 v77.78,13.02 | v108.51,75.11 108.39,75.24 v87.31,75.24
LS15  (via drill 0.35)
  Top 0.254: 68.76,90.1 62.16,90.1 61.27,90.99 61.27,92.69 U1.9
  Top 0.406: C16.2 v68.74,10.13 R32.2 64.49,9.53 65.33,8.69 81.46,8.69 86.92,14.15 91.11,14.15 111.18,34.22 111.18,36.76 114.86,40.44 114.86,56.44 115.63,57.21 115.63,69.02 108.51,76.13 v108.01,76.13 | v84.13,77.4 71.43,90.1 68.76,90.1
  Bottom 0.406: LS15.E 68.74,7.95 v68.74,10.13 | v108.01,76.13 85.4,76.13 v84.13,77.4
LS16  (via drill 0.35)  (1 unrouted)
  Top 0.406: R34.2 v57.8,12.08 58.73,11.15 58.73,9.2 58.78,9.15 C17.2
  Bottom 0.406: LS16.E 58.59,6.66 57.46,6.66 57.46,11.74 v57.8,12.08
LS17  (via drill 0.35)  (1 unrouted)
  Top 0.406: R36.2 47.3,15.51 47.3,12.91 v48.52,11.69 C18.2
  Bottom 0.406: LS17.E 48.73,7.77 47.3,9.2 47.3,10.47 v48.52,11.69
LS18  (via drill 0.35)  (1 unrouted)
  Top 0.406: R38.2 38.39,15.17 v39.48,14.08 C19.2
  Bottom 0.406: LS18.E 38.64,13.24 v39.48,14.08
LS19  (via drill 0.35)  (1 unrouted)
  Top 0.406: C20.2 30.91,18.56 v30.91,19.36 R40.2
  Bottom 0.406: LS19.E 29.52,15.66 29.52,19.36 v30.91,19.36
LS20  (via drill 0.35)  (1 unrouted)
  Top 0.406: C21.2 v24.04,25.71 24.04,30.4 R42.2
  Bottom 0.406: LS20.E v24.04,25.71
LS21  (via drill 0.35)  (1 unrouted)
  Top 0.406: R44.2 19.56,36.07 16.82,33.33 v16.82,32.65 C22.2
  Bottom 0.406: LS21.E v16.82,32.65
LS22  (via drill 0.35)
  Top 0.254: 46.41,91.11 57.59,91.11 57.75,91.28 U1.2
  Top 0.406: C23.2 v13.02,42.22 13.02,43.59 R46.2 16.31,46.88 16.31,48.82 17.71,50.22 17.71,61.4 18.22,61.91 18.22,65.84 43.49,91.11 46.41,91.11
  Bottom 0.406: LS22.E v13.02,42.22
LS23  (via drill 0.35)
  Top 0.254: 56.19,91.75 57.21,91.75 57.25,91.79 U1.1
  Top 0.406: C24.2 10.13,51.26 v10.86,51.99 R48.2 14.37,56.66 16.82,59.11 16.82,61.4 17.58,62.16 17.58,66.22 43.11,91.75 56.19,91.75
  Bottom 0.406: LS23.E v10.86,51.99
LS24  (via drill 0.35)
  Top 0.254: 41.71,94.04 55.84,94.04 U1.48
  Top 0.406: C25.2 v10.45,61.3 13.64,64.49 R50.2 16.23,66.35 16.82,66.35 20.63,70.16 20.63,75.49 38.16,93.02 40.7,93.02 41.71,94.04
  Bottom 0.406: LS24.E v10.45,61.3
LS25  (via drill 0.35)
  Top 0.254: 41.46,94.54 55.85,94.54 U1.47
  Top 0.406: C26.2 v11.69,71.48 13.52,73.31 R52.2 16.16,73.31 17.2,74.35 18.6,74.35 37.77,93.53 40.44,93.53 41.46,94.54
  Bottom 0.406: LS25.E v11.69,71.48
LS26  (via drill 0.35)
  Top 0.254: 41.08,95.05 55.86,95.05 U1.46
  Top 0.406: C27.2 v14.72,81.15 15.17,81.61 R54.2 20.27,81.61 20.63,81.97 21.27,81.97 21.52,81.72 22.92,81.72 35.36,94.16 40.19,94.16 41.08,95.05
  Bottom 0.406: LS26.E v14.72,81.15
LS27  (via drill 0.35)
  Top 0.254: 40.82,95.56 55.87,95.56 U1.45
  Top 0.406: C28.2 v19.36,88.25 23.72,88.25 R56.2 29.4,89.09 35.11,94.8 40.06,94.8 40.82,95.56
  Bottom 0.406: LS27.E v19.36,88.25
LS28  (via drill 0.35)
  Top 0.254: 41.46,98.61 53.14,98.61 53.67,98.08 U1.40
  Top 0.406: C29.2 v25.71,95.96 30.4,95.96 R58.2 38.29,95.44 41.46,98.61
  Bottom 0.406: LS28.E v25.71,95.96
LS29  (via drill 0.35)
  Top 0.254: 49.84,99.37 53.27,99.37 54.06,98.58 U1.39
  Top 0.406: C30.2 32.12,101.91 v34.6,101.91 37.14,101.91 38.39,100.66 R60.2 40.39,100.44 41.46,99.37 49.84,99.37
  Bottom 0.406: LS29.E v34.6,101.91
LS30  (via drill 0.35)
  Top 0.254: 50.48,100.51 52.89,100.51 54.28,99.12 55.85,99.12 U1.38
  Top 0.406: C31.2 v43.49,106.98 43.59,106.98 R62.2 47.01,103.56 47.68,103.56 48.06,103.18 48.06,102.93 50.48,100.51
  Bottom 0.406: LS30.E v43.49,106.98
LS31  (via drill 0.35)
  Top 0.254: 54.16,101.91 54.16,100.51 55.09,99.58 U1.37
  Top 0.406: v51.11,112.07 51.11,110.9 C32.2 51.26,109.87 R64.2 55.9,105.63 56.83,104.7 56.83,103.43 55.3,101.91 54.16,101.91
  Bottom 0.406: v51.11,112.07 51.11,112.2 LS31.E
N$1  (via drill 0.35)
  Top 0.406: R1.1 58.01,104.15 v57.97,104.2
  Bottom 0.406: LED0.A 60.75,115.77 60.76,115.75 58.09,115.75 57.97,115.63 v57.97,104.2
N$2  (via drill 0.35)
  Top 0.406: R3.1 v67.37,103.3 v67.37,103.31
  Bottom 0.406: LED1.A 71.95,115.26 71.94,115.25 68.25,115.25 67.37,114.36 v67.37,103.31
N$3  (via drill 0.35)
  Top 0.406: R5.1 76.36,100.79 v75.62,101.53
  Bottom 0.406: LED2.A 82.48,112.62 82.48,111.44 79.69,111.44 75.62,107.37 v75.62,101.53
N$4  (via drill 0.35)
  Top 0.406: R7.1 83.88,97.36 v83.88,98.1
  Bottom 0.406: LED3.A 91.75,106.57 91.75,106.48 89.72,106.48 89.21,106.99 83.88,101.66 v83.88,98.1
N$5  (via drill 0.35)  (1 unrouted)
  Top 0.406: R9.1 90.48,91.96 v90.48,93.02
  Bottom 0.406: LED4.A 100.56,99.5 98.23,99.5 97.59,100.13 v90.48,93.02 | 91.11,91.11 91.24,91.11
N$6  (via drill 0.35)
  Top 0.406: R11.1 96.71,85.77 v96.58,85.91
  Bottom 0.406: LED5.A 107.83,91.32 106.99,90.48 105.72,91.75 102.42,91.75 v96.58,85.91
N$7  (via drill 0.35)
  Top 0.406: R13.1 100.79,77.93 v101.91,79.05
  Bottom 0.406: LED6.A 111.08,81.31 109.53,82.86 106.35,82.86 102.55,79.05 v101.91,79.05
N$8  (via drill 0.35)
  Top 0.406: R15.1 103.3,69.4 106.35,72.46 v106.35,72.7
  Bottom 0.406: LED7.A 115.18,70.48 112.96,72.7 v106.35,72.7
N$9  (via drill 0.35)
  Top 0.406: R17.1 104.45,60.3 104.45,61.27 v105.97,62.79
  Bottom 0.406: LED8.A 116.5,59.25 116.39,59.37 116.39,60.13 113.72,62.79 v105.97,62.79
N$10  (via drill 0.35)
  Top 0.406: R19.1 104.45,52.53 v104.45,53.02
  Bottom 0.406: LED9.A 114.1,50.19 114.1,50.6 111.69,53.02 v104.45,53.02
N$11  (via drill 0.35)
  Top 0.406: v104.45,44.76 R21.1
  Bottom 0.406: LED10.A 110.8,42.22 v104.45,44.76
N$12  (via drill 0.35)
  Top 0.406: R23.1 97.11,35.87 v101.91,35.87
  Bottom 0.406: LED11.A 106.99,27.83 106.99,30.79 v101.91,35.87
N$13  (via drill 0.35)
  Top 0.406: R25.1 91.96,29.52 v94.04,29.52
  Bottom 0.406: LED12.A 100.13,23.43 v94.04,29.52
N$14  (via drill 0.35)
  Top 0.406: R27.1 84.65,23.17 v86.67,23.17
  Bottom 0.406: LED13.A 91.32,13.85 91.75,14.28 91.75,18.09 v86.67,23.17
N$15  (via drill 0.35)
  Top 0.406: R29.1 77.93,19.21 v82.86,14.28
  Bottom 0.406: LED14.A 81.31,8.92 82.86,10.47 v82.86,14.28
N$16  (via drill 0.35)
  Top 0.406: R31.1 70.04,16.7 v70.16,16.82
  Bottom 0.406: LED15.A 70.48,4.44 72.7,6.66 72.7,14.28 v70.16,16.82
N$17  (via drill 0.35)
  Top 0.406: R33.1 62.54,13.31 v62.54,13.01
  Bottom 0.406: LED16.A 59.25,3.37 60,4.12 62.54,4.12 v62.54,13.01
N$18  (via drill 0.35)
  Top 0.406: v53.65,7.93 53.65,14.44 R35.1
  Bottom 0.406: LED17.A 48.57,4.27 48.57,5.39 52.38,5.39 53.65,6.66 v53.65,7.93
N$19  (via drill 0.35)
  Top 0.406: v44.76,18.09 43.64,19.21 R37.1
  Bottom 0.406: LED18.A 37.64,7.16 38.41,7.93 42.22,7.93 44.76,10.47 v44.76,18.09
N$20  (via drill 0.35)
  Top 0.406: v35.87,20.63 35.87,22.89 R39.1
  Bottom 0.406: LED19.A 27.83,13.01 32.06,13.01 35.87,16.82 v35.87,20.63
N$21  (via drill 0.35)
  Top 0.406: v28.25,23.17 29.52,27.62 R41.1
  Bottom 0.406: LED20.A 21.39,19.87 21.9,19.36 v28.25,23.17
N$22  (via drill 0.35)
  Top 0.406: v23.17,32.06 R43.1
  Bottom 0.406: LED21.A 15.55,28.25 v23.17,32.06
N$23  (via drill 0.35)
  Top 0.406: v11.74,37.14 14.28,37.14 19.36,40.95 R45.1
  Bottom 0.406: LED22.A 9.2,38.41 10.47,37.14 v11.74,37.14
N$24  (via drill 0.35)
  Top 0.406: v15.55,48.57 R47.1
  Bottom 0.406: LED23.A 6.66,47.3 v15.55,48.57
N$25  (via drill 0.35)
  Top 0.406: R49.1 v14.28,57.46 12.88,56.06 7.55,56.06 7.42,56.19 v6.66,56.19
  Bottom 0.406: LED24.A 4.12,60 4.12,56.19 v6.66,56.19
N$26  (via drill 0.35)
  Top 0.406: v14.28,66.35 R51.1
  Bottom 0.406: LED25.A 5.39,68.89 v14.28,66.35
N$27  (via drill 0.35)
  Top 0.406: R53.1 v18.09,75.24
  Bottom 0.406: v18.09,75.24 10.47,76.51 7.93,80.32 7.93,81.59 LED26.A
N$28  (via drill 0.35)
  Top 0.406: R55.1 v21.65,82.61
  Bottom 0.406: v21.65,82.61 13.01,87.94 LED27.A
N$29  (via drill 0.35)
  Top 0.406: R57.1 25.71,90.48 v20.63,95.56
  Bottom 0.406: v20.63,95.56 19.36,98.1 20.63,99.37 LED28.A
N$30  (via drill 0.35)
  Top 0.406: R59.1 32.06,96.83 v26.98,103.18
  Bottom 0.406: v26.98,103.18 29.52,106.99 LED29.A
N$31  (via drill 0.35)
  Top 0.406: R61.1 39.68,101.91 37.14,109.53 39.05,112.07 v38.92,111.94
  Bottom 0.406: v38.92,111.94 LED30.A
N$32  (via drill 0.35)
  Top 0.406: R63.1 v48.95,103.31
  Bottom 0.406: v48.95,103.31 47.3,113.34 LED31.A